# Altium schematic sheet LEDS.SchDoc: LEDS
size A4
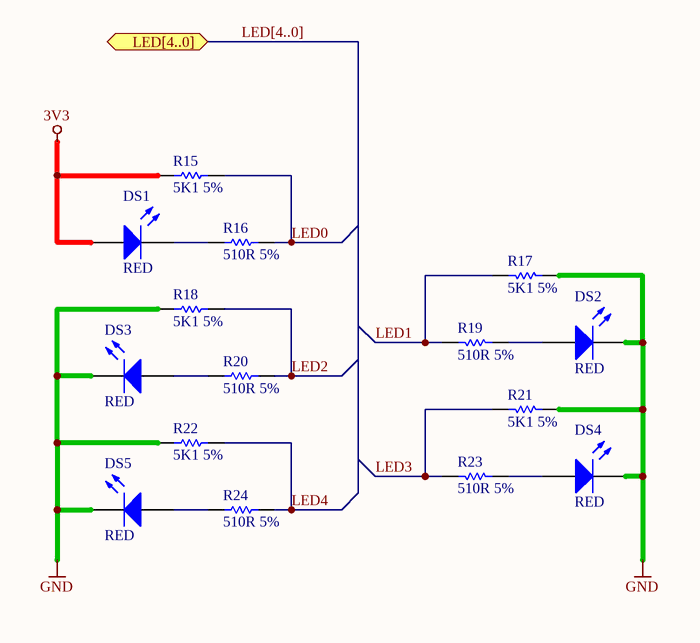
[diagram p0: LEDS.SchDoc]

## Parts
DS1  RED  [LED2013]
DS2  RED  [LED2013]
DS3  RED  [LED2013]
DS4  RED  [LED2013]
DS5  RED  [LED2013]
R15  5K1 5%  [RESC2012]
R16  510R 5%  [RESC2012]
R17  5K1 5%  [RESC2012]
R18  5K1 5%  [RESC2012]
R19  510R 5%  [RESC2012]
R20  510R 5%  [RESC2012]
R21  5K1 5%  [RESC2012]
R22  5K1 5%  [RESC2012]
R23  510R 5%  [RESC2012]
R24  510R 5%  [RESC2012]

## Ports
LED[4..0] (bidir)

## Nets
3V3: DS1.1(A) R15.1
GND: DS2.2(K) DS3.2(K) DS4.2(K) DS5.2(K) R17.1 R18.1 R21.1 R22.1
LED0: R15.2 R16.2
LED1: R17.2 R19.2
LED2: R18.2 R20.2
LED3: R21.2 R23.2
LED4: R22.2 R24.2
NetDS1_2: DS1.2(K) R16.1
NetDS2_1: DS2.1(A) R19.1
NetDS3_1: DS3.1(A) R20.1
NetDS4_1: DS4.1(A) R23.1
NetDS5_1: DS5.1(A) R24.1

## Buses and harness runs
bus LED[4..0] = port LED[4..0]

## Notes on the sheet
- Title
- Size:
- Date:
- A4
- Number:
- Time:
- Revision:
- Sheet
- of
- File:

## Library data of the parts
DS1-DS5 = DIO-LED-1S: Typical GREEN SMD LED Agilent make
R15-R24 = RES: Resistor